# Altium schematic sheet Main Schematic.SchDoc
size A4
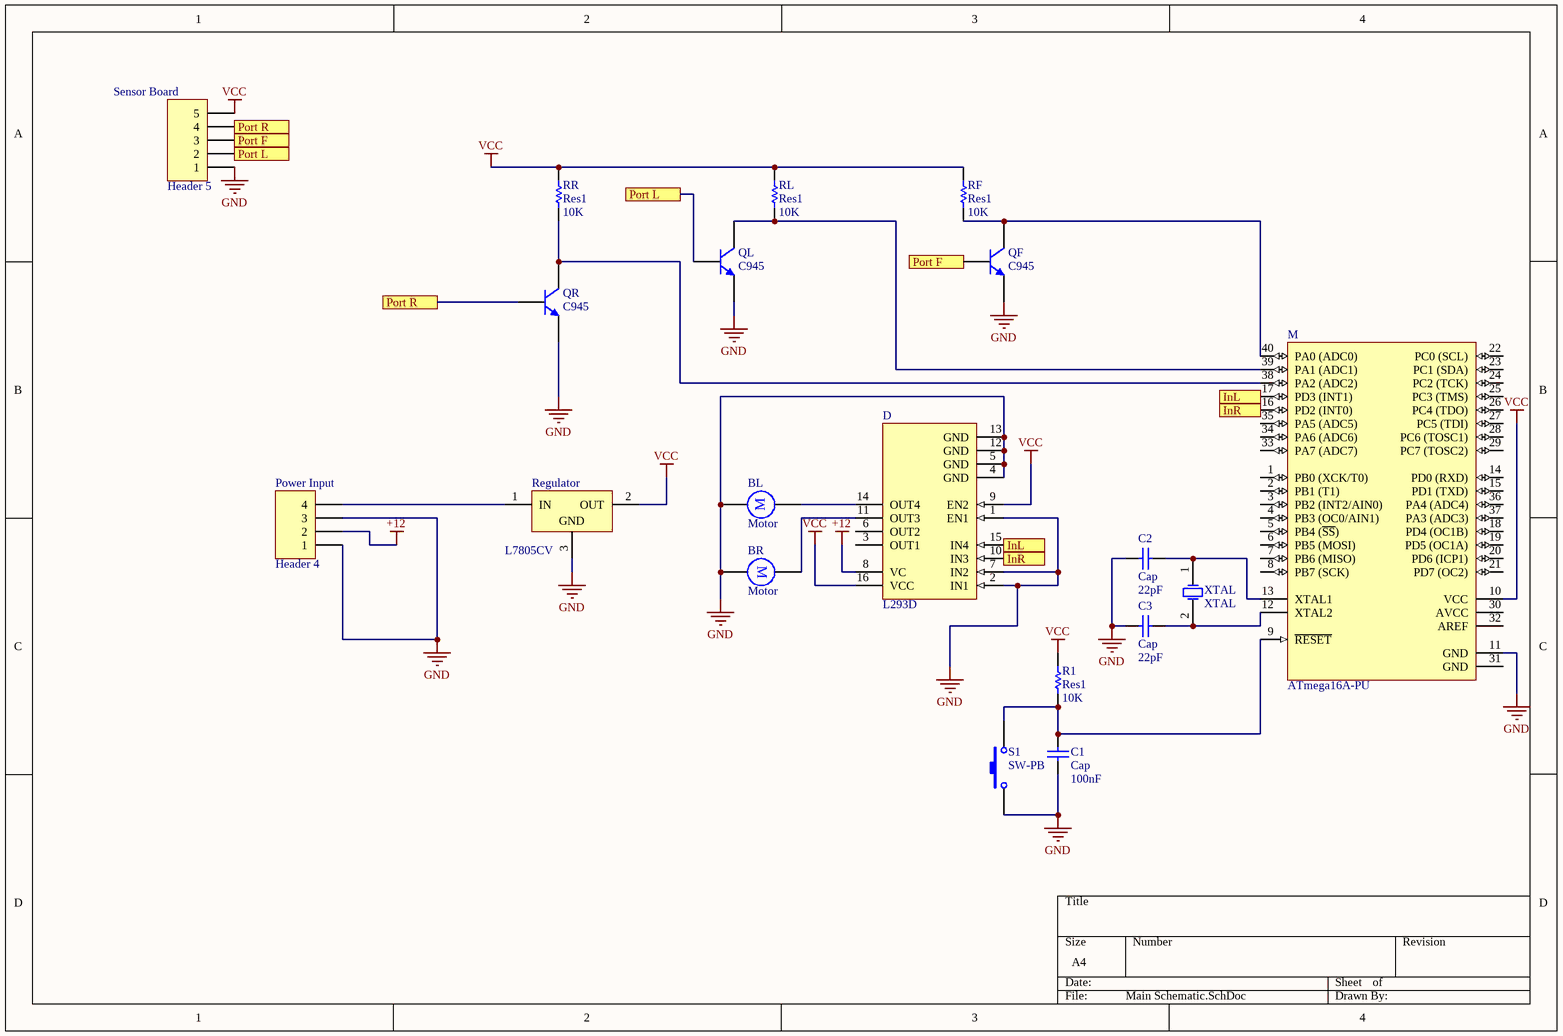
[diagram p0: Main Schematic.SchDoc]

## Parts
BL  Motor  [RB5-10.5]
BR  Motor  [RB5-10.5]
C1  Cap  value 100nF  [RAD-0.3]
C2  Cap  value 22pF  [RAD-0.3]
C3  Cap  value 22pF  [RAD-0.3]
D  L293D  [DIP16]
M  ATmega16A-PU  [40P6]
Power_Input  Header 4  [HDR1X4]
QF  C945  [TO-92A]
QL  C945  [TO-92A]
QR  C945  [TO-92A]
R1  Res1  value 10K  [AXIAL-0.3]
Regulator  L7805CV  [TO220ABN]
RF  Res1  value 10K  [AXIAL-0.3]
RL  Res1  value 10K  [AXIAL-0.3]
RR  Res1  value 10K  [AXIAL-0.3]
S1  SW-PB  [SPST-2]
Sensor_Board  Header 5  [HDR1X5]
XTAL  XTAL  [R38]

## Ports
InL, InR, Port F, Port L, Port R

## Nets
+12: D.8(VC) Power_Input.2
GND: BL.1 BR.2 C1.1 C2.1 C3.1 D.1(EN1) D.2(IN1) D.4(GND) D.5(GND) D.7(IN2) D.12(GND) D.13(GND) M.11(GND) Power_Input.1 Power_Input.3 QF.1(E) QL.1(E) QR.1(E) Regulator.3(GND) S1.1 Sensor_Board.1
VCC: D.9(EN2) D.16(VCC) M.10(VCC) R1.2 Regulator.2(OUT) RF.2 RL.2 RR.2 Sensor_Board.5
InL: D.15(IN4) M.17(PD3_(INT1)) ; port InL
InR: D.10(IN3) M.16(PD2_(INT0)) ; port InR
Port F: QF.3(B) Sensor_Board.3 ; port Port F
Port L: QL.3(B) Sensor_Board.2 ; port Port L
Port R: QR.3(B) Sensor_Board.4 ; port Port R
NetBL_2: BL.2 D.14(OUT4)
NetBR_1: BR.1 D.11(OUT3)
NetC1_2: C1.2 M.9(~{RESET}) R1.1 S1.2
NetC2_2: C2.2 M.13(XTAL1) XTAL.1(OSC1)
NetC3_2: C3.2 M.12(XTAL2) XTAL.2(OSC2)
NetM_38: M.38(PA2_(ADC2)) QR.2(C) RR.1
NetM_39: M.39(PA1_(ADC1)) QL.2(C) RL.1
NetM_40: M.40(PA0_(ADC0)) QF.2(C) RF.1
NetPower_Input_4: Power_Input.4 Regulator.1(IN)

Not connected (* = marked no-connect by the designer): D 3(OUT1) 6(OUT2); M 1(PB0_(XCK/T0)) 2(PB1_(T1)) 3(PB2_(INT2/AIN0)) 4(PB3_(OC0/AIN1)) 5(PB4_(~{SS})) 6(PB5_(MOSI)) 7(PB6_(MISO)) 8(PB7_(SCK)) 14(PD0_(RXD)) 15(PD1_(TXD)) 18(PD4_(OC1B)) 19(PD5_(OC1A)) 20(PD6_(ICP1)) 21(PD7_(OC2)) 22(PC0_(SCL)) 23(PC1_(SDA)) 24(PC2_(TCK)) 25(PC3_(TMS)) 26(PC4_(TDO)) 27(PC5_(TDI)) 28(PC6_(TOSC1)) 29(PC7_(TOSC2)) 30(AVCC) 31(GND) 32(AREF) 33(PA7_(ADC7)) 34(PA6_(ADC6)) 35(PA5_(ADC5)) 36(PA4_(ADC4)) 37(PA3_(ADC3))

## Notes on the sheet
- (in symbol Motor) M

## Library data of the parts
BL BR = Motor: Motor, General Kind; Published: 24-Mar-1999; LatestRevisionDate: 17-Jul-2002; LatestRevisionNote: Re-released for DXP Platform.; PackageReference: RB5-10.5; Publisher: Altium Limited; PackageDescription: Capacitor (Radial); 2 Leads
C1-C3 = Cap: Capacitor; Published: 8-Jun-2000; LatestRevisionDate: 17-Jul-2002; LatestRevisionNote: Re-released for DXP Platform.; PackageReference: RAD-0.3; Publisher: Altium Limited; PackageDescription: Radial Cap, Thru-Hole; 2 Leads; 0.3 in Pin Spacing
D = L293D: Push-Pull Four Channel Driver With Diode; Published: 8-Jun-2000; LatestRevisionDate: 06-Jun-2005; LatestRevisionNote: Stylized 3D Model Added.; DatasheetVersion: Jun-1996; PackageVersion: Apr-1996; PackageReference: DIP16; Publisher: Altium Limited; PackageDescription: DIP; 16 Leads; Row Spacing 7.62 mm; Pitch 2.54 mm; ComponentLink1Description: Manufacturer Link; ComponentLink1URL: http://www.st.com/; ComponentLink2Description: Datasheet; ComponentLink2URL: http://www.st.com/stonline/products/literature/ds/1330/l293d.pdf
M = ATmega16A-PU: 8-bit AVR Microcontroller, 16KB Flash, 512 Bytes EEPROM, 1KB SRAM, 40-pin PDIP, Industrial Grade (-40°C to 85°C); Published: 1-Apr-2010; DatasheetVersion: revB, Jul-2009; PackageVersion: revB, Sep-2001; PackageReference: 40P6; Publisher: Altium Limited; PackageDescription: 40-lead (0.600"/15.24mm Wide) Plastic Dual Inline Package (PDIP); Supplier 1: Digi-Key; Supplier Part Number 1: ATMEGA16A-PU-ND; Supplier 2: Farnell; Supplier Part Number 2: 1704561; Supplier 3: Mouser; Supplier Part Number 3: 556-ATMEGA16A-PU; Code_JEDEC: MS-011-AC; ComponentLink1Description: Manufacturer Link; ComponentLink1URL: http://www.atmel.com/products/avr/default.asp?; ComponentLink2Description: ATmega16A Datasheet; ComponentLink2URL: http://www.atmel.com/dyn/resources/prod_documents/doc8154.pdf; ComponentLink3Description: ATmega16A Summary; ComponentLink3URL: http://www.atmel.com/dyn/resources/prod_documents/8154S.pdf; ComponentLink4Description: Atmel.com Home; ComponentLink4URL: http://www.atmel.com
Power_Input = Header 4: Header, 4-Pin; LatestRevisionDate: 17-Jul-2002; LatestRevisionNote: Re-released for DXP Platform.; Publisher: Altium Limited
QF QL QR = 2N3904: NPN General Purpose Amplifier; Published: 8-Jun-2000; LatestRevisionDate: 15-Jan-2003; LatestRevisionNote: PCB Footprint 'BCY-W3/D4.7' replaced; DatasheetVersion: 1997; PackageVersion: Sep-1998; PackageReference: TO-92A; Publisher: Altium Limited; PackageDescription: TO, Flat Index; 3 In-Line, Axial Leads; Body Dia. 4.5mm; Leads 0.51 x 0.48 mm (max); ComponentLink1Description: Manufacturer Link; ComponentLink1URL: http://www.fairchildsemi.com/; ComponentLink2Description: Datasheet; ComponentLink2URL: http://www.fairchildsemi.com/ds/2N%2F2N3904.pdf
R1 RF RL RR = Res1: Resistor; Published: 8-Jun-2000; LatestRevisionDate: 17-Jul-2002; LatestRevisionNote: Re-released for DXP Platform.; PackageReference: AXIAL-0.3; Publisher: Altium Limited; PackageDescription: Axial Device, Thru-Hole; 2 Leads; 0.3 in Pin Spacing
Regulator = L7805CV: Positive Voltage Regulator; Note: Tab is connected to pin 3 (GND).; Published: 24-Aug-2001; LatestRevisionDate: 17-Jul-2002; LatestRevisionNote: Re-released for DXP Platform.; DatasheetVersion: Dec-1998; PackageVersion: Jun-1998; PackageReference: TO220ABN; Publisher: Altium Limited; PackageDescription: TO, Thru-Hole, Vertical, Heatsink Mounted; 3 In-Line Leads; Pitch 2.54 mm; Pin sequence 1, 3, 2; ComponentLink1Description: Manufacturer Link; ComponentLink1URL: http://www.st.com/
S1 = SW-PB: Switch; Published: 24-Mar-1999; LatestRevisionDate: 17-Jul-2002; LatestRevisionNote: Re-released for DXP Platform.; PackageReference: SPST-2; Publisher: Altium Limited; PackageDescription: Switch; 2 Leads
Sensor_Board = Header 5: Header, 5-Pin; LatestRevisionDate: 17-Jul-2002; LatestRevisionNote: Re-released for DXP Platform.; Publisher: Altium Limited
XTAL = XTAL: Crystal Oscillator; Published: 8-Jun-2000; LatestRevisionDate: 17-Jul-2002; LatestRevisionNote: Re-released for DXP Platform.; PackageReference: R38; Publisher: Altium Limited; PackageDescription: Crystal, Thru-Hole; 2 Leads; Body 3.1 x 8.2 mm (Dia.xH)